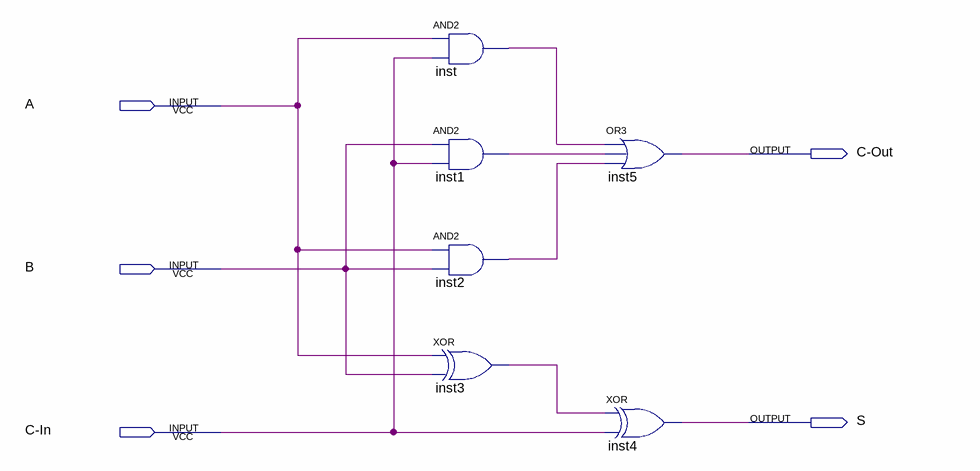
[diagram p0: schematic sheet]
// Quartus schematic FullAdder1.bdf as structural Verilog: 6 symbols, 5 pins
module FullAdder1 (
  input  A,
  input  B,
  input  \C-In ,
  output \C-Out ,
  output S
);

  wire inst1_out, inst2_out, inst3_out, inst_out;

  and inst (inst_out, A, \C-In );
  and inst1 (inst1_out, B, \C-In );
  and inst2 (inst2_out, A, B);
  xor inst3 (inst3_out, A, B);
  or inst5 (\C-Out , inst_out, inst1_out, inst2_out);
  xor inst4 (S, inst3_out, \C-In );
endmodule
